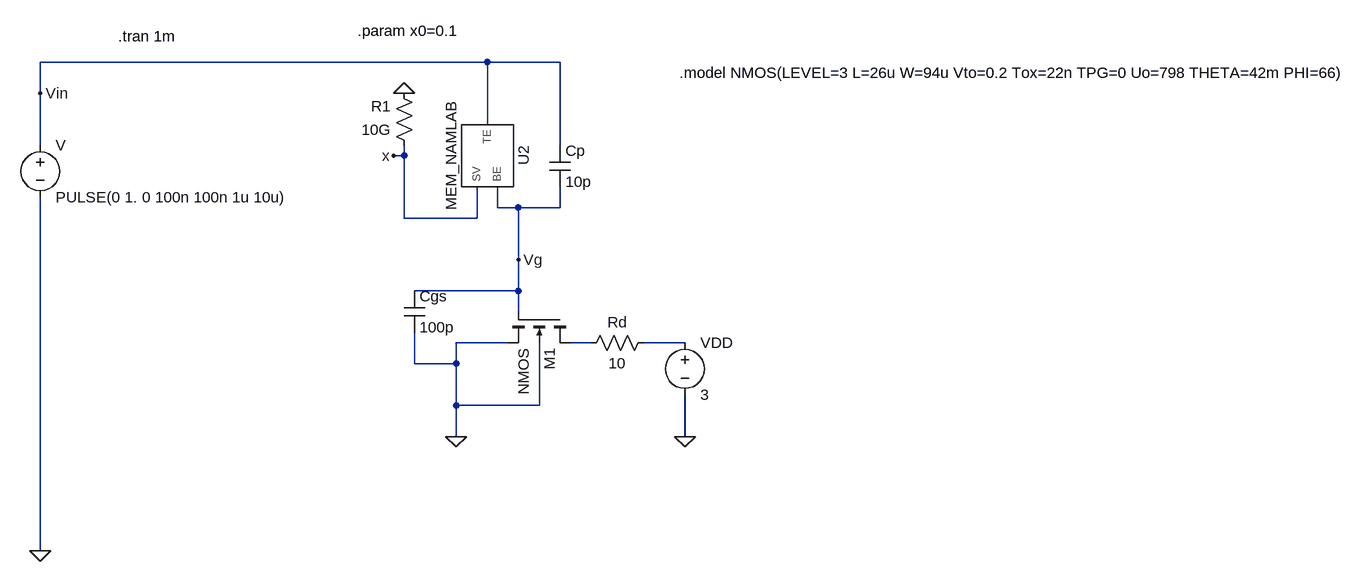
[diagram p0: schematic neuro_memristor _test.asc]
neuro_memristor _test.asc, the LTspice schematic file:
Version 4
SHEET 1 1940 960
WIRE 480 -160 -208 -160
WIRE 592 -160 480 -160
WIRE -208 -112 -208 -160
WIRE 480 -64 480 -160
WIRE -208 -32 -208 -112
WIRE 592 -32 592 -160
WIRE 352 -16 352 -32
WIRE 352 -16 336 -16
WIRE 496 64 496 32
WIRE 528 64 496 64
WIRE 592 64 592 32
WIRE 592 64 528 64
WIRE 352 80 352 -16
WIRE 464 80 464 32
WIRE 464 80 352 80
WIRE 528 144 528 64
WIRE 528 192 528 144
WIRE 528 192 368 192
WIRE 528 224 528 192
WIRE 512 272 432 272
WIRE 640 272 608 272
WIRE 784 272 720 272
WIRE 368 304 368 256
WIRE 432 304 432 272
WIRE 432 304 368 304
WIRE 432 368 432 304
WIRE 560 368 560 272
WIRE 560 368 432 368
WIRE 432 416 432 368
WIRE 784 416 784 352
WIRE -208 592 -208 48
FLAG -208 592 0
FLAG 336 -16 x
FLAG 784 416 0
FLAG 432 416 0
FLAG -208 -112 Vin
FLAG 528 144 Vg
FLAG 352 -112 0
SYMBOL voltage -208 -48 R0
WINDOW 123 0 0 Left 0
WINDOW 39 0 0 Left 0
SYMATTR InstName V
SYMATTR Value PULSE(0 1. 0 100n 100n 1u 10u)
SYMBOL voltage 784 256 R0
SYMATTR InstName VDD
SYMATTR Value 3
SYMBOL res 736 256 R90
WINDOW 0 0 56 VBottom 2
WINDOW 3 32 56 VTop 2
SYMATTR InstName Rd
SYMATTR Value 10
SYMBOL nmos4 608 224 R90
SYMATTR InstName M1
SYMBOL cap 352 192 R0
SYMATTR InstName Cgs
SYMATTR Value 100p
SYMBOL cap 576 -32 R0
SYMATTR InstName Cp
SYMATTR Value 10p
SYMBOL res 368 -16 R180
WINDOW 0 36 76 Left 2
WINDOW 3 36 40 Left 2
SYMATTR InstName R1
SYMATTR Value 10G
SYMBOL MEM_NAMLAB 480 -16 R90
SYMATTR InstName U2
TEXT -88 -200 Left 2 !.tran 1m
TEXT 280 -208 Left 2 !.param x0=0.1
TEXT 776 -144 Left 2 !.model NMOS(LEVEL=3 L=26u W=94u Vto=0.2 Tox=22n TPG=0 Uo=798 THETA=42m PHI=66)

The netlist it stands for:
* neuro_memristor _test.asc
V Vin 0 PULSE(0 1. 0 100n 100n 1u 10u)
VDD N002 0 3
Rd N002 N001 10
M1 N001 Vg 0 0 NMOS
Cgs Vg 0 100p
Cp Vin Vg 10p
R1 x 0 10G
XU2 Vin Vg x MEM_NAMLAB  ; pins TE BE SV
.model NMOS NMOS
.model PMOS PMOS
.lib standard.mos
.tran 1m
.param x0=0.1
.model NMOS(LEVEL=3 L=26u W=94u Vto=0.2 Tox=22n TPG=0 Uo=798 THETA=42m PHI=66)
.lib C:\Users\dhanu\OneDrive\Documents\My files\GITHUB\Neuro-transistor-Simulation-with-Memristor-based-Memcapacitor-using-LTSPICE\src\task9\MEM_NAMLAB.cir
.backanno
.end